# Altium schematic sheet SchematicV2.schdoc
size 881 x 502 mm
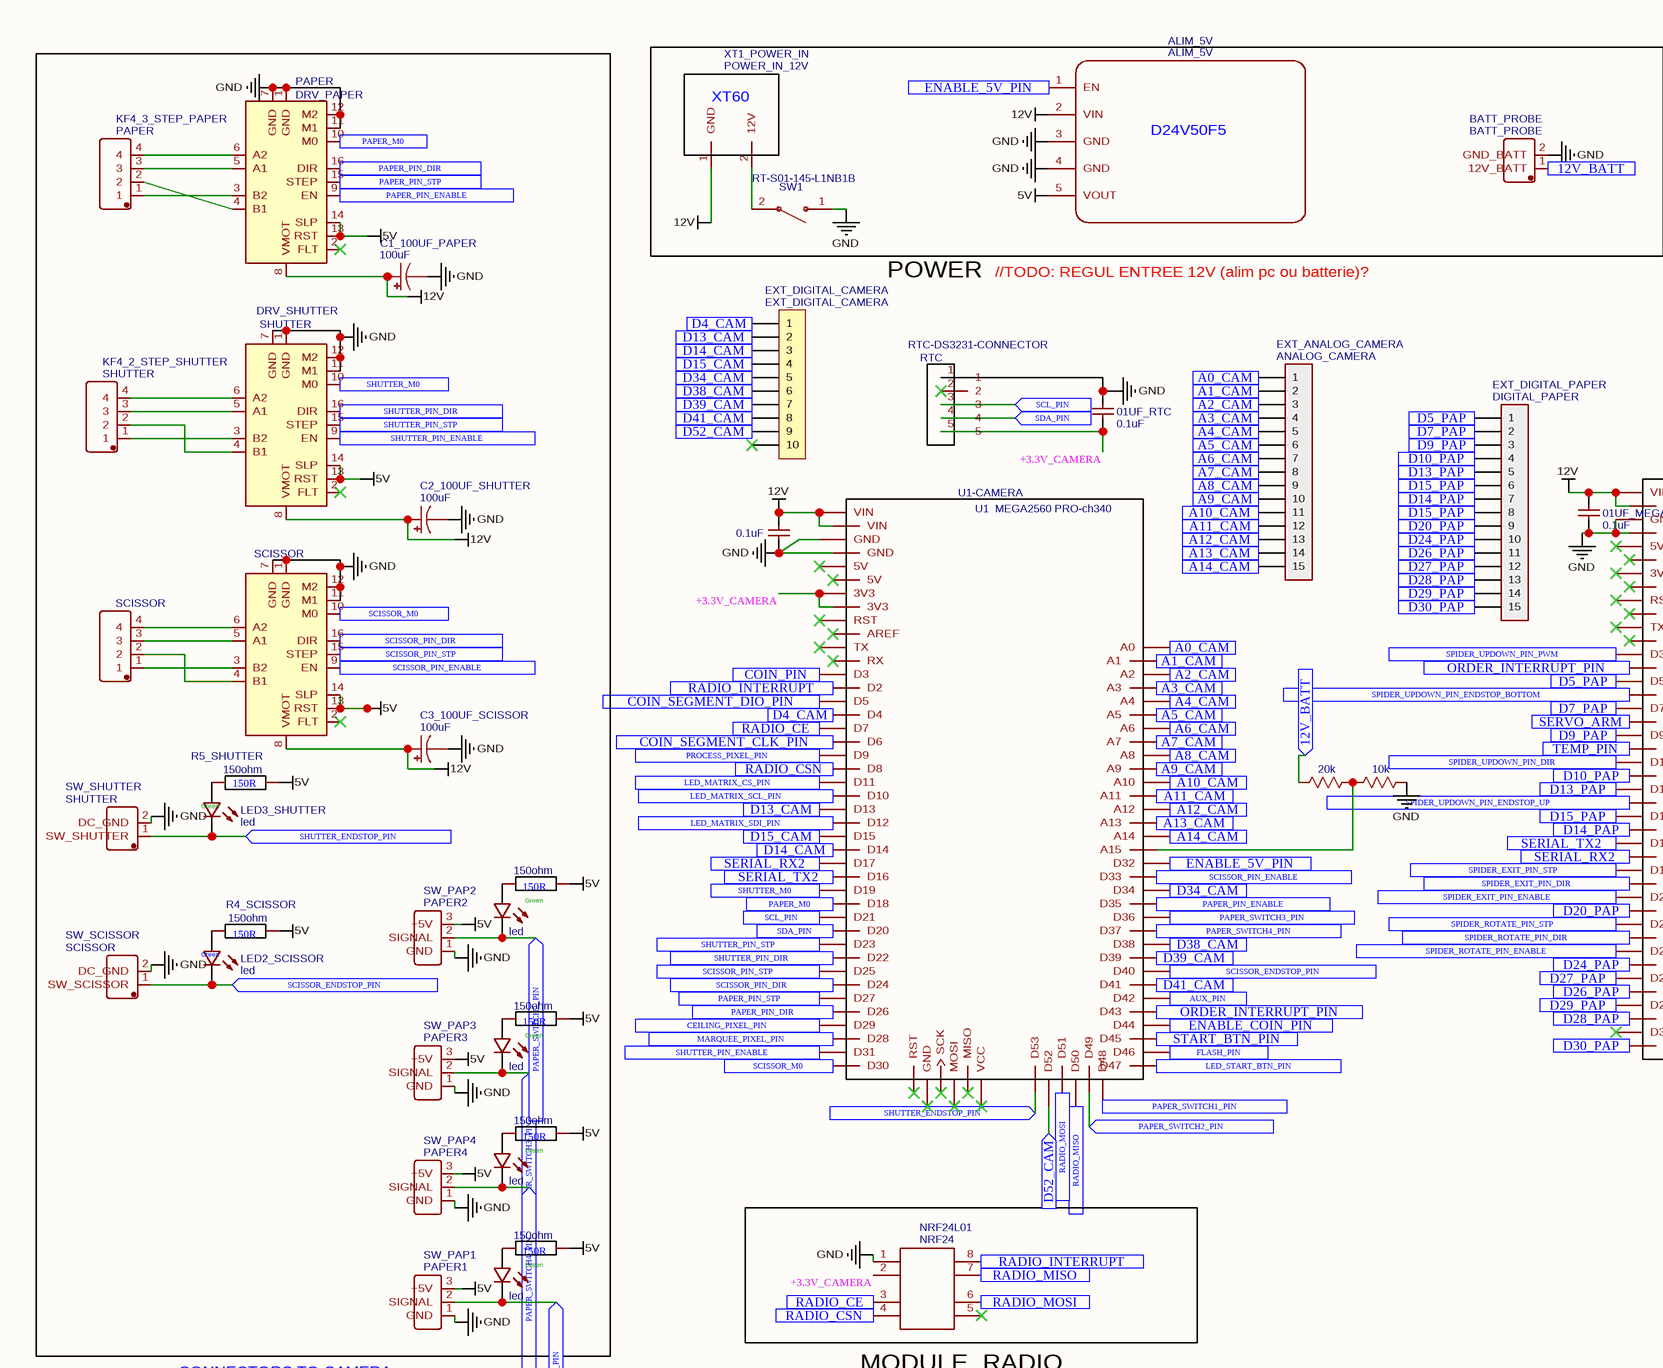
[diagram p0: SchematicV2.schdoc, top left]
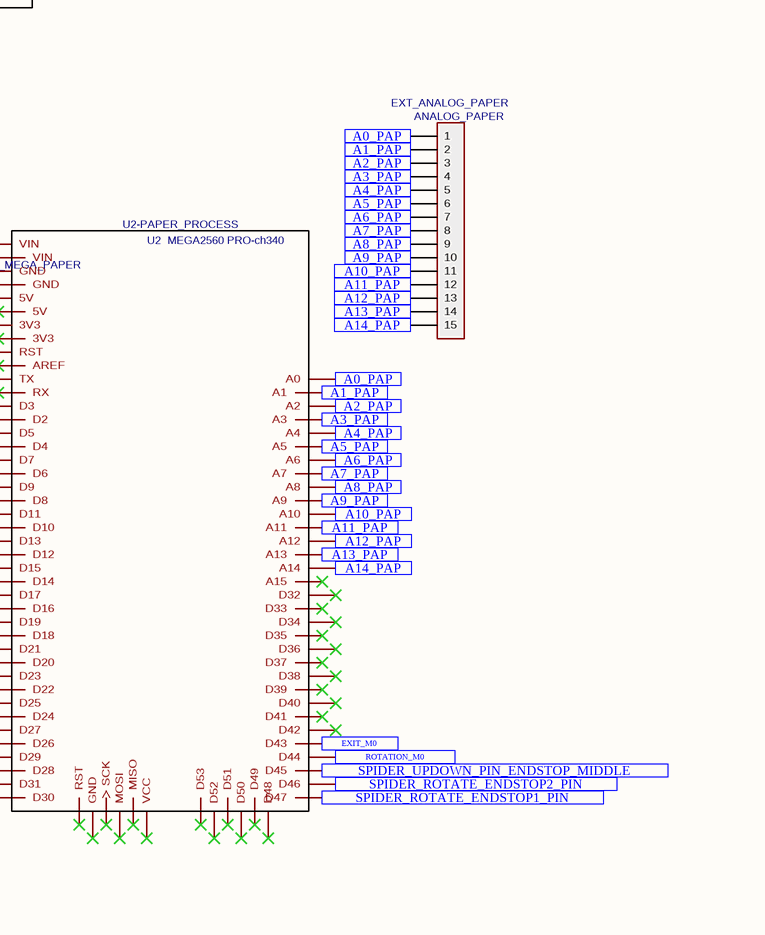
[diagram p1: SchematicV2.schdoc, top right]
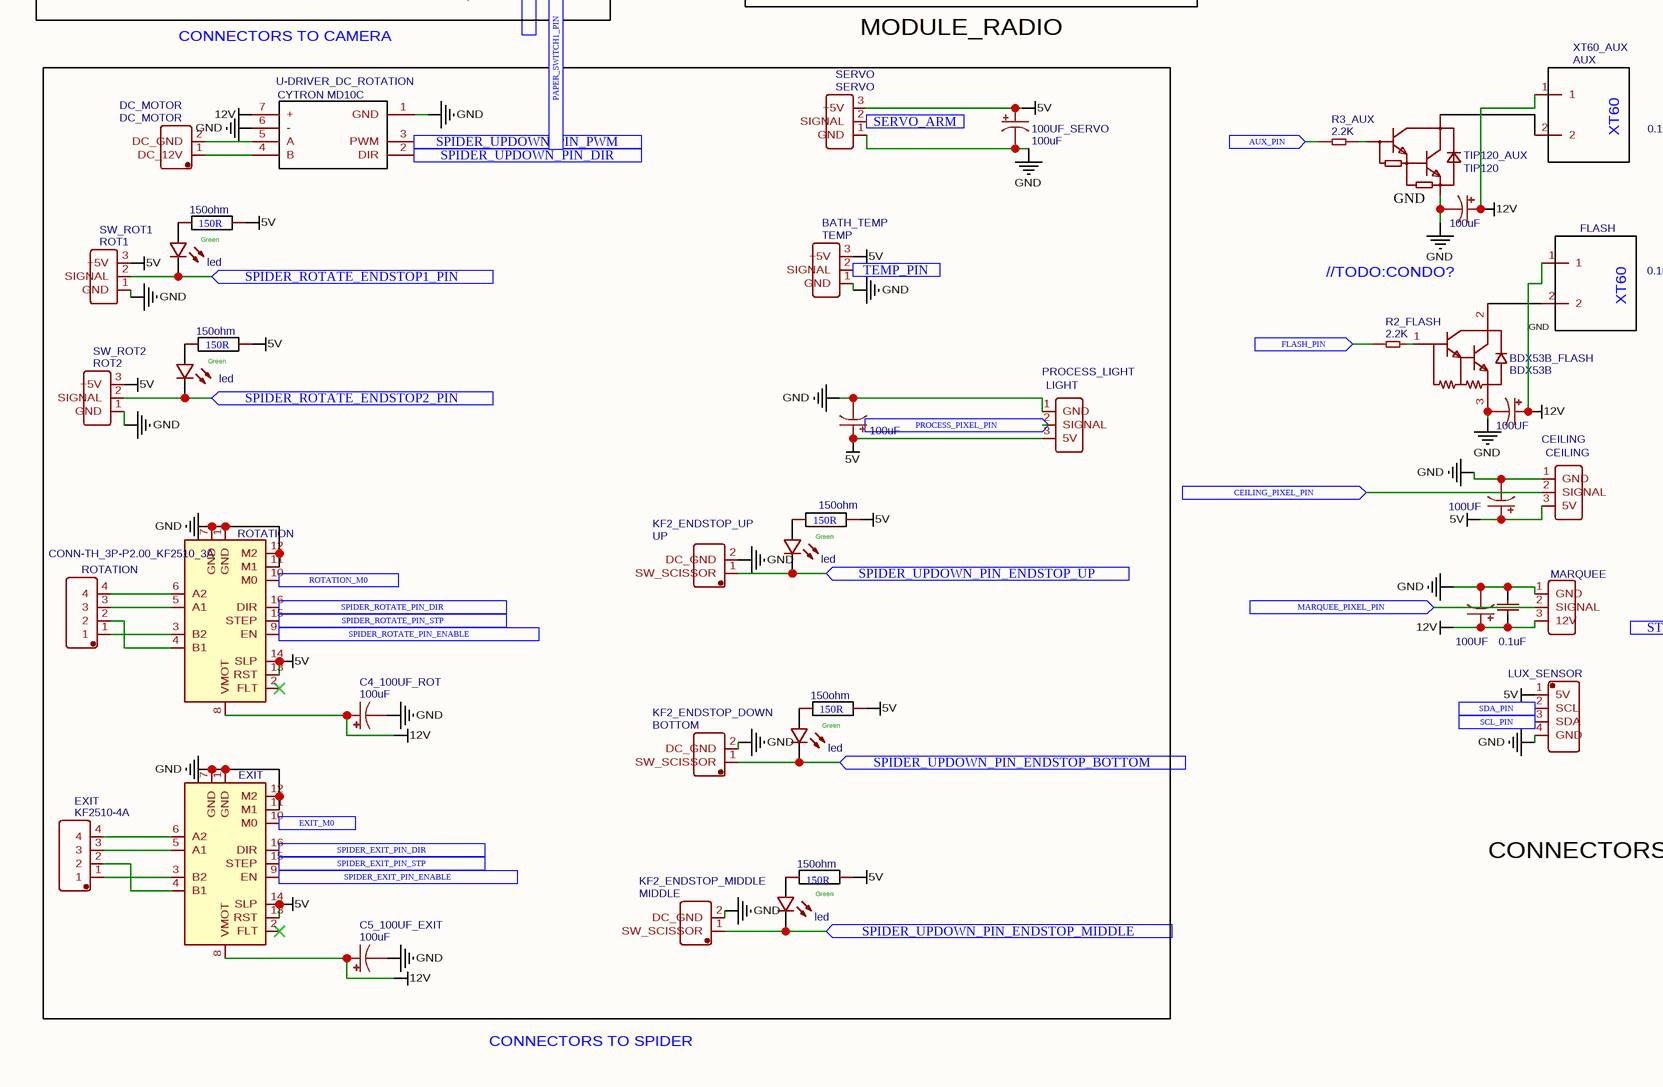
[diagram p2: SchematicV2.schdoc, bottom left]
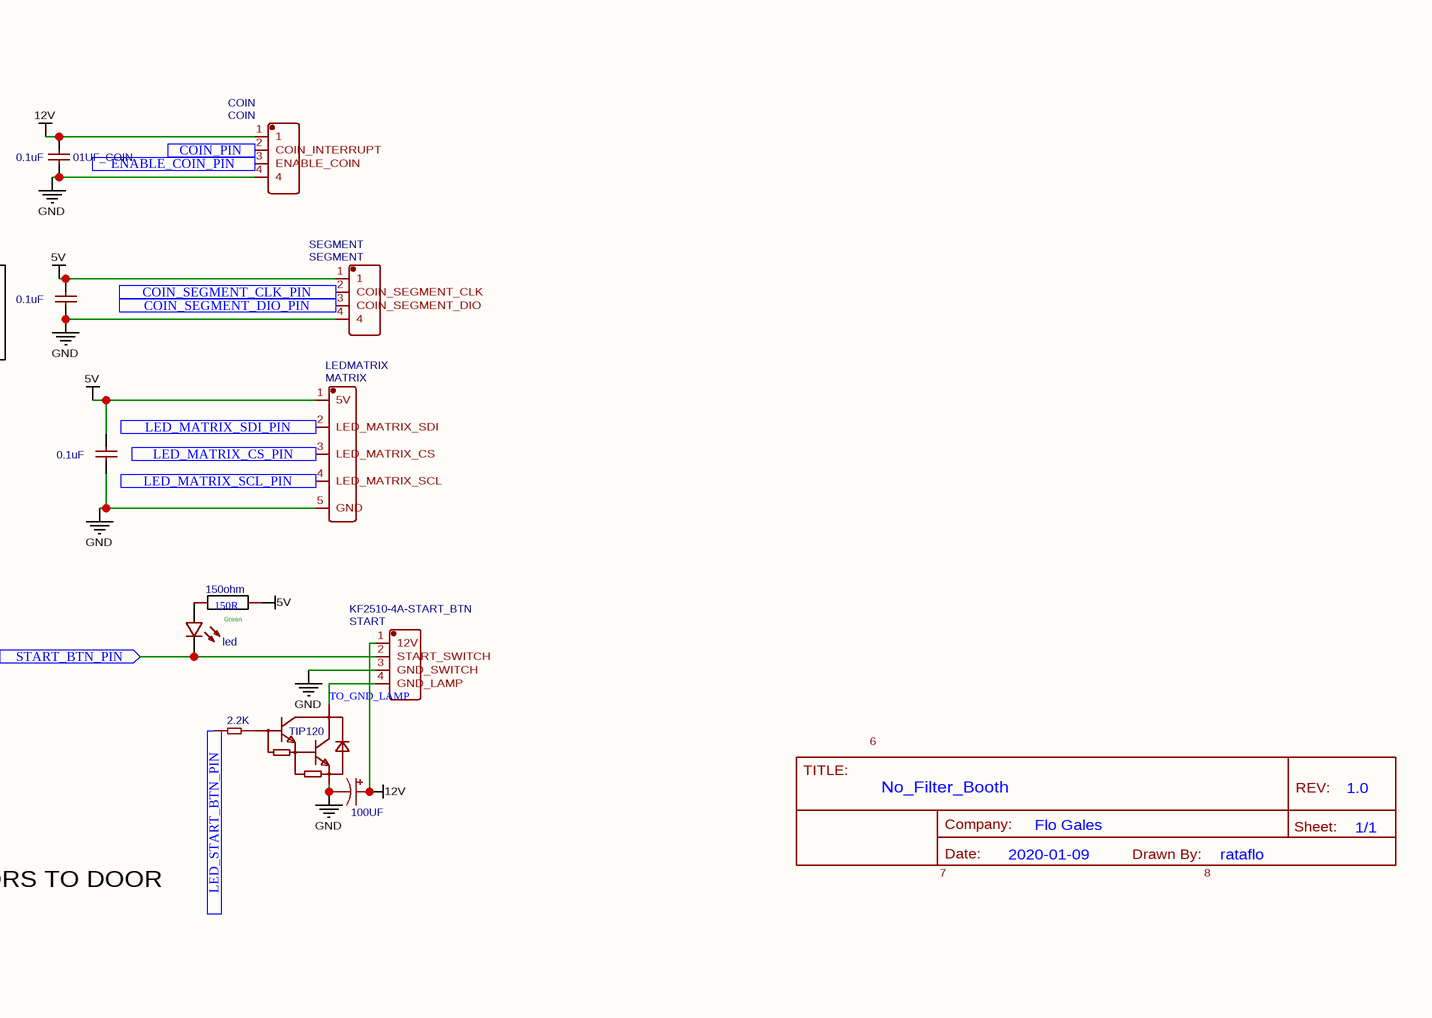
[diagram p3: SchematicV2.schdoc, bottom right]

## Parts
01UF_COIN  0.1uF  [100NF_CONDO]
01UF_MARQUEE  0.1uF  [100NF_CONDO]
01UF_MATRIX  0.1uF  [100NF_CONDO]
01UF_MEGA_PAPER  0.1uF  [100NF_CONDO]
01UF_RTC  0.1uF  [100NF_CONDO]
01UF_SEGMENT  0.1uF  [100NF_CONDO]
100UF_AUX  100uF  [CPOL-RADIAL-100UF-25V]
100UF_CEILING  100UF  [CPOL-RADIAL-100UF-25V]
100UF_FLASH  100UF  [CPOL-RADIAL-100UF-25V]
100UF_MARQUEE  100UF  [CPOL-RADIAL-100UF-25V]
100UF_MEGA_CAMERA  0.1uF  [100NF_CONDO]
100UF_PROCESS_LIGHT  100uF  [CPOL-RADIAL-100UF-25V]
100UF_SERVO  100uF  [CPOL-RADIAL-100UF-25V]
100UF_STARTBTN  100UF  [CPOL-RADIAL-100UF-25V]
ALIM_5V  ALIM_5V  [D24V50F5]
BATH_TEMP  TEMP  [CONN-TH_3P-P2.00_KF2510_3A]
BATT_PROBE  BATT_PROBE  [CONN-TH_KF2510-2A]
BDX53B_FLASH  BDX53B  [TO-220]
C1_100UF_PAPER  100uF  [CPOL-RADIAL-100UF-25V]
C2_100UF_SHUTTER  100uF  [CPOL-RADIAL-100UF-25V]
C3_100UF_SCISSOR  100uF  [CPOL-RADIAL-100UF-25V]
C4_100UF_ROT  100uF  [CPOL-RADIAL-100UF-25V]
C5_100UF_EXIT  100uF  [CPOL-RADIAL-100UF-25V]
CEILING  CEILING  [CONN-TH_3P-P2.00_KF2510_3A]
COIN  COIN  [CONN-TH_4P-P2.54_KF2510-4A]
DC_MOTOR  DC_MOTOR  [CONN-TH_KF2510-2A]
DRV_EXIT  EXIT  [POLOLU_BREAKOUT-16_15.2X20.3MM]
DRV_PAPER  PAPER  [POLOLU_BREAKOUT-16_15.2X20.3MM]
DRV_ROT  ROTATION  [POLOLU_BREAKOUT-16_15.2X20.3MM]
DRV_SCISSOR  SCISSOR  [POLOLU_BREAKOUT-16_15.2X20.3MM]
DRV_SHUTTER  SHUTTER  [POLOLU_BREAKOUT-16_15.2X20.3MM]
EXIT  KF2510-4A  [CONN-TH_4P-P2.54_KF2510-4A]
EXT_ANALOG_CAMERA  ANALOG_CAMERA  [DUPONT_MALE_16X1_ARNOZ]
EXT_ANALOG_PAPER  ANALOG_PAPER  [DUPONT_MALE_16X1_ARNOZ]
EXT_DIGITAL_CAMERA  EXT_DIGITAL_CAMERA  [1*10P_FEMALE]
EXT_DIGITAL_PAPER  DIGITAL_PAPER  [DUPONT_MALE_16X1_ARNOZ]
KF2_ENDSTOP_DOWN  BOTTOM  [CONN-TH_KF2510-2A]
KF2_ENDSTOP_MIDDLE  MIDDLE  [CONN-TH_KF2510-2A]
KF2_ENDSTOP_UP  UP  [CONN-TH_KF2510-2A]
KF4_2_STEP_SHUTTER  SHUTTER  [CONN-TH_4P-P2.54_KF2510-4A]
KF4_3_STEP_PAPER  PAPER  [CONN-TH_4P-P2.54_KF2510-4A]
KF2510-4A-START_BTN  START  [CONN-TH_4P-P2.54_KF2510-4A]
KF2510-4A_ROT  ROTATION  [CONN-TH_4P-P2.54_KF2510-4A]
LED  led  [5MM_LED_2.54]
LED2_SCISSOR  led  [5MM_LED_2.54]
LED3_SHUTTER  led  [5MM_LED_2.54]
LED__MIDDLE  led  [5MM_LED_2.54]
LED__START  led  [5MM_LED_2.54]
LED_BOTTOM  led  [5MM_LED_2.54]
LED_PAP1  led  [5MM_LED_2.54]
LED_PAP2  led  [5MM_LED_2.54]
LED_PAP3  led  [5MM_LED_2.54]
LED_PAP4  led  [5MM_LED_2.54]
LED_ROT2  led  [5MM_LED_2.54]
LED_UP  led  [5MM_LED_2.54]
LEDMATRIX  MATRIX  [KF2510-5A]
LUX_SENSOR  LUX_SENSOR  [CONN-TH_4P-P2.54_KF2510-4A]
MARQUEE  MARQUEE  [CONN-TH_3P-P2.00_KF2510_3A]
NRF24L01  NRF24  [HEADER 4X2]
PROCESS_LIGHT  LIGHT  [CONN-TH_3P-P2.00_KF2510_3A]
R1_20K_12VBATT  20k  [PKG-0.25W RESISTOR]
R1_START  150ohm  [ER_RESISTOR_150R/0.6_W]
R1_STARTBTN  2.2K  [RES-2.3]
R1_UP  150ohm  [ER_RESISTOR_150R/0.6_W]
R2_10K_12VBATT  10k  [PKG-0.25W RESISTOR]
R2_BOTTOM  150ohm  [ER_RESISTOR_150R/0.6_W]
R2_FLASH  2.2K  [RES-2.3]
R3_AUX  2.2K  [RES-2.3]
R3_MIDDLE  150ohm  [ER_RESISTOR_150R/0.6_W]
R4_SCISSOR  150ohm  [ER_RESISTOR_150R/0.6_W]
R5_SHUTTER  150ohm  [ER_RESISTOR_150R/0.6_W]
R_PAP1  150ohm  [ER_RESISTOR_150R/0.6_W]
R_PAP2  150ohm  [ER_RESISTOR_150R/0.6_W]
R_PAP3  150ohm  [ER_RESISTOR_150R/0.6_W]
R_PAP4  150ohm  [ER_RESISTOR_150R/0.6_W]
R_ROT1  150ohm  [ER_RESISTOR_150R/0.6_W]
R_ROT2  150ohm  [ER_RESISTOR_150R/0.6_W]
RTC-DS3231-CONNECTOR  RTC  [5PIN DUPONT]
SEGMENT  SEGMENT  [CONN-TH_4P-P2.54_KF2510-4A]
SERVO  SERVO  [CONN-TH_3P-P2.00_KF2510_3A]
STEP_SCISSOR  SCISSOR  [CONN-TH_4P-P2.54_KF2510-4A]
SW1  RT-S01-145-L1NB1B  [SW-TH_RT-S01-145-L1NB1B]
SW_PAP1  PAPER1  [CONN-TH_3P-P2.00_KF2510_3A]
SW_PAP2  PAPER2  [CONN-TH_3P-P2.00_KF2510_3A]
SW_PAP3  PAPER3  [CONN-TH_3P-P2.00_KF2510_3A]
SW_PAP4  PAPER4  [CONN-TH_3P-P2.00_KF2510_3A]
SW_ROT1  ROT1  [CONN-TH_3P-P2.00_KF2510_3A]
SW_ROT2  ROT2  [CONN-TH_3P-P2.00_KF2510_3A]
SW_SCISSOR  SCISSOR  [CONN-TH_KF2510-2A]
SW_SHUTTER  SHUTTER  [CONN-TH_KF2510-2A]
TEST  test2  (value not drawn)
TIP120_AUX  TIP120  [TO-220-3_L10.0-W4.5-P2.54-L]
TIP120_STARTBTN  TIP120  [TO-220-3_L10.0-W4.5-P2.54-L]
U1-CAMERA  CAMERA  [MEGA2560 PRO-CH340G]  (value not drawn)
U2-PAPER_PROCESS  PAPER_PROCESS  [MEGA2560 PRO-CH340G]  (value not drawn)
U-DRIVER_DC_ROTATION  CYTRON MD10C  [MD10C]
XT1_POWER_IN  POWER_IN_12V  [XT60]
XT60-FLASH  FLASH  [XT60]
XT60_AUX  AUX  [XT60]

## Ports
12V_BATT (in), A0_CAM (in), A0_PAP (in), A1_CAM (in), A1_PAP (in), A2_CAM (in), A2_PAP (in), A3_CAM (in), A3_PAP (in), A4_CAM (in), A4_PAP (in), A5_CAM (in), A5_PAP (in), A6_CAM (in), A6_PAP (in), A7_CAM (in), A7_PAP (in), A8_CAM (in), A8_PAP (in), A9_CAM (in), A9_PAP (in), A10_CAM (in), A10_PAP (in), A11_CAM (in), A11_PAP (in), A12_CAM (in), A12_PAP (in), A13_CAM (in), A13_PAP (in), A14_CAM (in), A14_PAP (in), AUX_PIN (in), CEILING_PIXEL_PIN (in), COIN_PIN (in), COIN_SEGMENT_CLK_PIN (in), COIN_SEGMENT_DIO_PIN (in), D4_CAM (in), D5_PAP (in), D7_PAP (in), D9_PAP (in), D10_PAP (in), D13_CAM (in), D13_PAP (in), D14_CAM (in), D14_PAP (in), D15_CAM (in), D15_PAP (in), D20_PAP (in), D24_PAP (in), D26_PAP (in), D27_PAP (in), D28_PAP (in), D29_PAP (in), D30_PAP (in), D34_CAM (in), D38_CAM (in), D39_CAM (in), D41_CAM (in), D52_CAM (in), ENABLE_5V_PIN (in), ENABLE_COIN_PIN (in), EXIT_M0 (in), FLASH_PIN (in), LED_MATRIX_CS_PIN (in), LED_MATRIX_SCL_PIN (in), LED_MATRIX_SDI_PIN (in), LED_START_BTN_PIN (in), MARQUEE_PIXEL_PIN (in), ORDER_INTERRUPT_PIN (in), PAPER_M0 (in), PAPER_PIN_DIR (in), PAPER_PIN_ENABLE (in), PAPER_PIN_STP (in), PAPER_SWITCH1_PIN (in), PAPER_SWITCH2_PIN (in), PAPER_SWITCH3_PIN (in), PAPER_SWITCH4_PIN (in), PROCESS_PIXEL_PIN (in), RADIO_CE (in), RADIO_CSN (in), RADIO_INTERRUPT (in), RADIO_MISO (in), RADIO_MOSI (in), ROTATION_M0 (in), SCISSOR_ENDSTOP_PIN (in), SCISSOR_M0 (in), SCISSOR_PIN_DIR (in), SCISSOR_PIN_ENABLE (in), SCISSOR_PIN_STP (in), SCL_PIN (in), SDA_PIN (in), SERIAL_RX2 (in), SERIAL_TX2 (in), SERVO_ARM (in), SHUTTER_ENDSTOP_PIN (in), SHUTTER_M0 (in), SHUTTER_PIN_DIR (in), SHUTTER_PIN_ENABLE (in), SHUTTER_PIN_STP (in), SPIDER_EXIT_PIN_DIR (in), SPIDER_EXIT_PIN_ENABLE (in), SPIDER_EXIT_PIN_STP (in), SPIDER_ROTATE_ENDSTOP1_PIN (in), SPIDER_ROTATE_ENDSTOP2_PIN (in), SPIDER_ROTATE_PIN_DIR (in), SPIDER_ROTATE_PIN_ENABLE (in), SPIDER_ROTATE_PIN_STP (in), SPIDER_UPDOWN_PIN_DIR (in), SPIDER_UPDOWN_PIN_ENDSTOP_BOTTOM (in), SPIDER_UPDOWN_PIN_ENDSTOP_MIDDLE (in), SPIDER_UPDOWN_PIN_ENDSTOP_UP (in), SPIDER_UPDOWN_PIN_PWM (in), START_BTN_PIN (in), TEMP_PIN (in)

## Nets
5V: 01UF_MATRIX.2 01UF_SEGMENT.2 100UF_CEILING.1(+) 100UF_PROCESS_LIGHT.1(+) 100UF_SERVO.1(+) ALIM_5V.5(VOUT) BATH_TEMP.3(+5V) CEILING.3(5V) DRV_EXIT.13(RST) DRV_EXIT.14(SLP) DRV_PAPER.13(RST) DRV_PAPER.14(SLP) DRV_ROT.13(RST) DRV_ROT.14(SLP) DRV_SCISSOR.13(RST) DRV_SCISSOR.14(SLP) DRV_SHUTTER.13(RST) DRV_SHUTTER.14(SLP) LEDMATRIX.1(5V) LUX_SENSOR.1(5V) PROCESS_LIGHT.3(5V) R1_START.1 R1_UP.1 R2_BOTTOM.1 R3_MIDDLE.1 R4_SCISSOR.1 R5_SHUTTER.1 R_PAP1.1 R_PAP2.1 R_PAP3.1 R_PAP4.1 R_ROT1.1 R_ROT2.1 SEGMENT.1 SERVO.3(+5V) SW_PAP1.3(+5V) SW_PAP2.3(+5V) SW_PAP3.3(+5V) SW_PAP4.3(+5V) SW_ROT1.3(+5V) SW_ROT2.3(+5V)
12V: 01UF_COIN.2 01UF_MARQUEE.1 01UF_MEGA_PAPER.2 100UF_AUX.1(+) 100UF_FLASH.1(+) 100UF_MARQUEE.1(+) 100UF_MEGA_CAMERA.2 100UF_STARTBTN.1(+) ALIM_5V.2(VIN) C1_100UF_PAPER.1(+) C2_100UF_SHUTTER.1(+) C3_100UF_SCISSOR.1(+) C4_100UF_ROT.1(+) C5_100UF_EXIT.1(+) COIN.1 DRV_EXIT.8(VMOT) DRV_PAPER.8(VMOT) DRV_ROT.8(VMOT) DRV_SCISSOR.8(VMOT) DRV_SHUTTER.8(VMOT) KF2510-4A-START_BTN.1(12V) MARQUEE.3(12V) U1-CAMERA.85(VIN) U1-CAMERA.86(VIN) U2-PAPER_PROCESS.85(VIN) U2-PAPER_PROCESS.86(VIN) U-DRIVER_DC_ROTATION.7(+) XT1_POWER_IN.1(GND) XT60-FLASH.1 XT60_AUX.1
GND: 01UF_COIN.1 01UF_MARQUEE.2 01UF_MATRIX.1 01UF_MEGA_PAPER.1 01UF_RTC.2 01UF_SEGMENT.1 100UF_AUX.2(-) 100UF_CEILING.2(-) 100UF_FLASH.2(-) 100UF_MARQUEE.2(-) 100UF_MEGA_CAMERA.1 100UF_PROCESS_LIGHT.2(-) 100UF_SERVO.2(-) 100UF_STARTBTN.2(-) ALIM_5V.3(GND) ALIM_5V.4(GND) BATH_TEMP.1(GND) BATT_PROBE.2(GND_BATT) BDX53B_FLASH.3(E) C1_100UF_PAPER.2(-) C2_100UF_SHUTTER.2(-) C3_100UF_SCISSOR.2(-) C4_100UF_ROT.2(-) C5_100UF_EXIT.2(-) CEILING.1(GND) COIN.4 DRV_EXIT.1(GND) DRV_EXIT.7(GND) DRV_EXIT.11(M1) DRV_EXIT.12(M2) DRV_PAPER.1(GND) DRV_PAPER.7(GND) DRV_PAPER.11(M1) DRV_PAPER.12(M2) DRV_ROT.1(GND) DRV_ROT.7(GND) DRV_ROT.11(M1) DRV_ROT.12(M2) DRV_SCISSOR.1(GND) DRV_SCISSOR.7(GND) DRV_SCISSOR.11(M1) DRV_SCISSOR.12(M2) DRV_SHUTTER.1(GND) DRV_SHUTTER.7(GND) DRV_SHUTTER.11(M1) DRV_SHUTTER.12(M2) KF2_ENDSTOP_DOWN.2(DC_GND) KF2_ENDSTOP_MIDDLE.2(DC_GND) KF2_ENDSTOP_UP.2(DC_GND) KF2510-4A-START_BTN.3(GND_SWITCH) LEDMATRIX.5(GND) LUX_SENSOR.4(GND) MARQUEE.1(GND) NRF24L01.1 PROCESS_LIGHT.1(GND) R2_10K_12VBATT.1 RTC-DS3231-CONNECTOR.1 SEGMENT.4 SERVO.1(GND) SW1.1 SW_PAP1.1(GND) SW_PAP2.1(GND) SW_PAP3.1(GND) SW_PAP4.1(GND) SW_ROT1.1(GND) SW_ROT2.1(GND) SW_SCISSOR.2(DC_GND) SW_SHUTTER.2(DC_GND) TIP120_AUX.3(E) TIP120_STARTBTN.3(E) U1-CAMERA.83(GND) U1-CAMERA.84(GND) U2-PAPER_PROCESS.83(GND) U2-PAPER_PROCESS.84(GND) U-DRIVER_DC_ROTATION.1(GND) U-DRIVER_DC_ROTATION.6(-)
12V_BATT: BATT_PROBE.1(12V_BATT) R1_20K_12VBATT.2 ; port 12V_BATT
+3.3V_CAMERA: 01UF_RTC.1 NRF24L01.2 RTC-DS3231-CONNECTOR.5 U1-CAMERA.79(3V3) U1-CAMERA.80(3V3)
A0_CAM: EXT_ANALOG_CAMERA.1 U1-CAMERA.1(A0) ; port A0_CAM
A0_PAP: EXT_ANALOG_PAPER.1 U2-PAPER_PROCESS.1(A0) ; port A0_PAP
A1_CAM: EXT_ANALOG_CAMERA.2 U1-CAMERA.2(A1) ; port A1_CAM
A1_PAP: EXT_ANALOG_PAPER.2 U2-PAPER_PROCESS.2(A1) ; port A1_PAP
A2_CAM: EXT_ANALOG_CAMERA.3 U1-CAMERA.3(A2) ; port A2_CAM
A2_PAP: EXT_ANALOG_PAPER.3 U2-PAPER_PROCESS.3(A2) ; port A2_PAP
A3_CAM: EXT_ANALOG_CAMERA.4 U1-CAMERA.4(A3) ; port A3_CAM
A3_PAP: EXT_ANALOG_PAPER.4 U2-PAPER_PROCESS.4(A3) ; port A3_PAP
A4_CAM: EXT_ANALOG_CAMERA.5 U1-CAMERA.5(A4) ; port A4_CAM
A4_PAP: EXT_ANALOG_PAPER.5 U2-PAPER_PROCESS.5(A4) ; port A4_PAP
A5_CAM: EXT_ANALOG_CAMERA.6 U1-CAMERA.6(A5) ; port A5_CAM
A5_PAP: EXT_ANALOG_PAPER.6 U2-PAPER_PROCESS.6(A5) ; port A5_PAP
A6_CAM: EXT_ANALOG_CAMERA.7 U1-CAMERA.7(A6) ; port A6_CAM
A6_PAP: EXT_ANALOG_PAPER.7 U2-PAPER_PROCESS.7(A6) ; port A6_PAP
A7_CAM: EXT_ANALOG_CAMERA.8 U1-CAMERA.8(A7) ; port A7_CAM
A7_PAP: EXT_ANALOG_PAPER.8 U2-PAPER_PROCESS.8(A7) ; port A7_PAP
A8_CAM: EXT_ANALOG_CAMERA.9 U1-CAMERA.9(A8) ; port A8_CAM
A8_PAP: EXT_ANALOG_PAPER.9 U2-PAPER_PROCESS.9(A8) ; port A8_PAP
A9_CAM: EXT_ANALOG_CAMERA.10 U1-CAMERA.10(A9) ; port A9_CAM
A9_PAP: EXT_ANALOG_PAPER.10 U2-PAPER_PROCESS.10(A9) ; port A9_PAP
A10_CAM: EXT_ANALOG_CAMERA.11 U1-CAMERA.11(A10) ; port A10_CAM
A10_PAP: EXT_ANALOG_PAPER.11 U2-PAPER_PROCESS.11(A10) ; port A10_PAP
A11_CAM: EXT_ANALOG_CAMERA.12 U1-CAMERA.12(A11) ; port A11_CAM
A11_PAP: EXT_ANALOG_PAPER.12 U2-PAPER_PROCESS.12(A11) ; port A11_PAP
A12_CAM: EXT_ANALOG_CAMERA.13 U1-CAMERA.13(A12) ; port A12_CAM
A12_PAP: EXT_ANALOG_PAPER.13 U2-PAPER_PROCESS.13(A12) ; port A12_PAP
A13_CAM: EXT_ANALOG_CAMERA.14 U1-CAMERA.14(A13) ; port A13_CAM
A13_PAP: EXT_ANALOG_PAPER.14 U2-PAPER_PROCESS.14(A13) ; port A13_PAP
A14_CAM: EXT_ANALOG_CAMERA.15 U1-CAMERA.15(A14) ; port A14_CAM
A14_PAP: EXT_ANALOG_PAPER.15 U2-PAPER_PROCESS.15(A14) ; port A14_PAP
AUX_PIN: R3_AUX.1 U1-CAMERA.27(D42) ; port AUX_PIN
CEILING_PIXEL_PIN: CEILING.2(SIGNAL) U1-CAMERA.48(D29) ; port CEILING_PIXEL_PIN
COIN_PIN: COIN.2(COIN_INTERRUPT) U1-CAMERA.74(D3) ; port COIN_PIN
COIN_SEGMENT_CLK_PIN: SEGMENT.2(COIN_SEGMENT_CLK) U1-CAMERA.69(D6) ; port COIN_SEGMENT_CLK_PIN
COIN_SEGMENT_DIO_PIN: SEGMENT.3(COIN_SEGMENT_DIO) U1-CAMERA.72(D5) ; port COIN_SEGMENT_DIO_PIN
D4_CAM: EXT_DIGITAL_CAMERA.1 U1-CAMERA.71(D4) ; port D4_CAM
D5_PAP: EXT_DIGITAL_PAPER.1 U2-PAPER_PROCESS.72(D5) ; port D5_PAP
D7_PAP: EXT_DIGITAL_PAPER.2 U2-PAPER_PROCESS.70(D7) ; port D7_PAP
D9_PAP: EXT_DIGITAL_PAPER.3 U2-PAPER_PROCESS.68(D9) ; port D9_PAP
D10_PAP: EXT_DIGITAL_PAPER.4 U2-PAPER_PROCESS.65(D10) ; port D10_PAP
D13_CAM: EXT_DIGITAL_CAMERA.2 U1-CAMERA.64(D13) ; port D13_CAM
D13_PAP: EXT_DIGITAL_PAPER.5 U2-PAPER_PROCESS.64(D13) ; port D13_PAP
D14_CAM: EXT_DIGITAL_CAMERA.3 U1-CAMERA.61(D14) ; port D14_CAM
D14_PAP: EXT_DIGITAL_PAPER.7 U2-PAPER_PROCESS.61(D14) ; port D14_PAP
D15_CAM: EXT_DIGITAL_CAMERA.4 U1-CAMERA.62(D15) ; port D15_CAM
D15_PAP: EXT_DIGITAL_PAPER.6 EXT_DIGITAL_PAPER.8 U2-PAPER_PROCESS.62(D15) ; port D15_PAP
D20_PAP: EXT_DIGITAL_PAPER.9 U2-PAPER_PROCESS.55(D20) ; port D20_PAP
D24_PAP: EXT_DIGITAL_PAPER.10 U2-PAPER_PROCESS.51(D24) ; port D24_PAP
D26_PAP: EXT_DIGITAL_PAPER.11 U2-PAPER_PROCESS.49(D26) ; port D26_PAP
D27_PAP: EXT_DIGITAL_PAPER.12 U2-PAPER_PROCESS.50(D27) ; port D27_PAP
D28_PAP: EXT_DIGITAL_PAPER.13 U2-PAPER_PROCESS.47(D28) ; port D28_PAP
D29_PAP: EXT_DIGITAL_PAPER.14 U2-PAPER_PROCESS.48(D29) ; port D29_PAP
D30_PAP: EXT_DIGITAL_PAPER.15 U2-PAPER_PROCESS.45(D30) ; port D30_PAP
D34_CAM: EXT_DIGITAL_CAMERA.5 U1-CAMERA.19(D34) ; port D34_CAM
D38_CAM: EXT_DIGITAL_CAMERA.6 U1-CAMERA.23(D38) ; port D38_CAM
D39_CAM: EXT_DIGITAL_CAMERA.7 U1-CAMERA.24(D39) ; port D39_CAM
D41_CAM: EXT_DIGITAL_CAMERA.8 U1-CAMERA.26(D41) ; port D41_CAM
D52_CAM: EXT_DIGITAL_CAMERA.9 U1-CAMERA.37(D52) ; port D52_CAM
ENABLE_5V_PIN: ALIM_5V.1(EN) U1-CAMERA.17(D32) ; port ENABLE_5V_PIN
ENABLE_COIN_PIN: COIN.3(ENABLE_COIN) U1-CAMERA.29(D44) ; port ENABLE_COIN_PIN
EXIT_M0: DRV_EXIT.10(M0) U2-PAPER_PROCESS.28(D43) ; port EXIT_M0
FLASH_PIN: R2_FLASH.1 U1-CAMERA.31(D46) ; port FLASH_PIN
LED_MATRIX_CS_PIN: LEDMATRIX.3(LED_MATRIX_CS) U1-CAMERA.66(D11) ; port LED_MATRIX_CS_PIN
LED_MATRIX_SCL_PIN: LEDMATRIX.4(LED_MATRIX_SCL) U1-CAMERA.65(D10) ; port LED_MATRIX_SCL_PIN
LED_MATRIX_SDI_PIN: LEDMATRIX.2(LED_MATRIX_SDI) U1-CAMERA.63(D12) ; port LED_MATRIX_SDI_PIN
LED_START_BTN_PIN: R1_STARTBTN.1 U1-CAMERA.32(D47) ; port LED_START_BTN_PIN
MARQUEE_PIXEL_PIN: MARQUEE.2(SIGNAL) U1-CAMERA.47(D28) ; port MARQUEE_PIXEL_PIN
ORDER_INTERRUPT_PIN: U1-CAMERA.28(D43) U2-PAPER_PROCESS.73(D2) ; port ORDER_INTERRUPT_PIN
PAPER_M0: DRV_PAPER.10(M0) U1-CAMERA.57(D18) ; port PAPER_M0
PAPER_PIN_DIR: DRV_PAPER.16(DIR) U1-CAMERA.49(D26) ; port PAPER_PIN_DIR
PAPER_PIN_ENABLE: DRV_PAPER.9(EN) U1-CAMERA.20(D35) ; port PAPER_PIN_ENABLE
PAPER_PIN_STP: DRV_PAPER.15(STEP) U1-CAMERA.50(D27) ; port PAPER_PIN_STP
PAPER_SWITCH1_PIN: LED_PAP1.2(C) SW_PAP1.2(SIGNAL) U1-CAMERA.33(D48) ; port PAPER_SWITCH1_PIN
PAPER_SWITCH2_PIN: LED_PAP2.2(C) SW_PAP2.2(SIGNAL) U1-CAMERA.34(D49) ; port PAPER_SWITCH2_PIN
PAPER_SWITCH3_PIN: LED_PAP3.2(C) SW_PAP3.2(SIGNAL) U1-CAMERA.21(D36) ; port PAPER_SWITCH3_PIN
PAPER_SWITCH4_PIN: LED_PAP4.2(C) SW_PAP4.2(SIGNAL) U1-CAMERA.22(D37) ; port PAPER_SWITCH4_PIN
PROCESS_PIXEL_PIN: PROCESS_LIGHT.2(SIGNAL) U1-CAMERA.68(D9) ; port PROCESS_PIXEL_PIN
RADIO_CE: NRF24L01.3 U1-CAMERA.70(D7) ; port RADIO_CE
RADIO_CSN: NRF24L01.4 U1-CAMERA.67(D8) ; port RADIO_CSN
RADIO_INTERRUPT: NRF24L01.8 U1-CAMERA.73(D2) ; port RADIO_INTERRUPT
RADIO_MISO: NRF24L01.7 U1-CAMERA.35(D50) ; port RADIO_MISO
RADIO_MOSI: NRF24L01.6 U1-CAMERA.36(D51) ; port RADIO_MOSI
ROTATION_M0: DRV_ROT.10(M0) U2-PAPER_PROCESS.29(D44) ; port ROTATION_M0
SCISSOR_ENDSTOP_PIN: LED2_SCISSOR.2(C) SW_SCISSOR.1(SW_SCISSOR) U1-CAMERA.25(D40) ; port SCISSOR_ENDSTOP_PIN
SCISSOR_M0: DRV_SCISSOR.10(M0) U1-CAMERA.45(D30) ; port SCISSOR_M0
SCISSOR_PIN_DIR: DRV_SCISSOR.16(DIR) U1-CAMERA.51(D24) ; port SCISSOR_PIN_DIR
SCISSOR_PIN_ENABLE: DRV_SCISSOR.9(EN) U1-CAMERA.18(D33) ; port SCISSOR_PIN_ENABLE
SCISSOR_PIN_STP: DRV_SCISSOR.15(STEP) U1-CAMERA.52(D25) ; port SCISSOR_PIN_STP
SCL_PIN: LUX_SENSOR.3(SDA) RTC-DS3231-CONNECTOR.3 U1-CAMERA.56(D21) ; port SCL_PIN
SDA_PIN: LUX_SENSOR.2(SCL) RTC-DS3231-CONNECTOR.4 U1-CAMERA.55(D20) ; port SDA_PIN
SERIAL_RX2: U1-CAMERA.60(D17) U2-PAPER_PROCESS.59(D16) ; port SERIAL_RX2
SERIAL_TX2: U1-CAMERA.59(D16) U2-PAPER_PROCESS.60(D17) ; port SERIAL_TX2
SERVO_ARM: SERVO.2(SIGNAL) U2-PAPER_PROCESS.69(D6) ; port SERVO_ARM
SHUTTER_ENDSTOP_PIN: LED3_SHUTTER.2(C) SW_SHUTTER.1(SW_SHUTTER) U1-CAMERA.38(D53) ; port SHUTTER_ENDSTOP_PIN
SHUTTER_M0: DRV_SHUTTER.10(M0) U1-CAMERA.58(D19) ; port SHUTTER_M0
SHUTTER_PIN_DIR: DRV_SHUTTER.16(DIR) U1-CAMERA.53(D22) ; port SHUTTER_PIN_DIR
SHUTTER_PIN_ENABLE: DRV_SHUTTER.9(EN) U1-CAMERA.46(D31) ; port SHUTTER_PIN_ENABLE
SHUTTER_PIN_STP: DRV_SHUTTER.15(STEP) U1-CAMERA.54(D23) ; port SHUTTER_PIN_STP
SPIDER_EXIT_PIN_DIR: DRV_EXIT.16(DIR) U2-PAPER_PROCESS.57(D18) ; port SPIDER_EXIT_PIN_DIR
SPIDER_EXIT_PIN_ENABLE: DRV_EXIT.9(EN) U2-PAPER_PROCESS.56(D21) ; port SPIDER_EXIT_PIN_ENABLE
SPIDER_EXIT_PIN_STP: DRV_EXIT.15(STEP) U2-PAPER_PROCESS.58(D19) ; port SPIDER_EXIT_PIN_STP
SPIDER_ROTATE_ENDSTOP1_PIN: LED.2(C) SW_ROT1.2(SIGNAL) U2-PAPER_PROCESS.32(D47) ; port SPIDER_ROTATE_ENDSTOP1_PIN
SPIDER_ROTATE_ENDSTOP2_PIN: LED_ROT2.2(C) SW_ROT2.2(SIGNAL) U2-PAPER_PROCESS.31(D46) ; port SPIDER_ROTATE_ENDSTOP2_PIN
SPIDER_ROTATE_PIN_DIR: DRV_ROT.16(DIR) U2-PAPER_PROCESS.53(D22) ; port SPIDER_ROTATE_PIN_DIR
SPIDER_ROTATE_PIN_ENABLE: DRV_ROT.9(EN) U2-PAPER_PROCESS.52(D25) ; port SPIDER_ROTATE_PIN_ENABLE
SPIDER_ROTATE_PIN_STP: DRV_ROT.15(STEP) U2-PAPER_PROCESS.54(D23) ; port SPIDER_ROTATE_PIN_STP
SPIDER_UPDOWN_PIN_DIR: U2-PAPER_PROCESS.66(D11) U-DRIVER_DC_ROTATION.2(DIR) ; port SPIDER_UPDOWN_PIN_DIR
SPIDER_UPDOWN_PIN_ENDSTOP_BOTTOM: KF2_ENDSTOP_DOWN.1(SW_SCISSOR) LED_BOTTOM.2(C) U2-PAPER_PROCESS.71(D4) ; port SPIDER_UPDOWN_PIN_ENDSTOP_BOTTOM
SPIDER_UPDOWN_PIN_ENDSTOP_MIDDLE: KF2_ENDSTOP_MIDDLE.1(SW_SCISSOR) LED__MIDDLE.2(C) U2-PAPER_PROCESS.30(D45) ; port SPIDER_UPDOWN_PIN_ENDSTOP_MIDDLE
SPIDER_UPDOWN_PIN_ENDSTOP_UP: KF2_ENDSTOP_UP.1(SW_SCISSOR) LED_UP.2(C) U2-PAPER_PROCESS.63(D12) ; port SPIDER_UPDOWN_PIN_ENDSTOP_UP
SPIDER_UPDOWN_PIN_PWM: U2-PAPER_PROCESS.74(D3) U-DRIVER_DC_ROTATION.3(PWM) ; port SPIDER_UPDOWN_PIN_PWM
START_BTN_PIN: KF2510-4A-START_BTN.2(START_SWITCH) LED__START.2(C) U1-CAMERA.30(D45) ; port START_BTN_PIN
TEMP_PIN: BATH_TEMP.2(SIGNAL) U2-PAPER_PROCESS.67(D8) ; port TEMP_PIN
TO_GND_LAMP: KF2510-4A-START_BTN.4(GND_LAMP) TIP120_STARTBTN.2(C)
NetBDX53B_FLASH_1: BDX53B_FLASH.1(B) R2_FLASH.2
NetBDX53B_FLASH_2: BDX53B_FLASH.2(C) XT60-FLASH.2
NetDC_MOTOR_1: DC_MOTOR.1(DC_12V) U-DRIVER_DC_ROTATION.4(B)
NetDC_MOTOR_2: DC_MOTOR.2(DC_GND) U-DRIVER_DC_ROTATION.5(A)
NetDRV_EXIT_3: DRV_EXIT.3(B2) EXIT.1
NetDRV_EXIT_4: DRV_EXIT.4(B1) EXIT.2
NetDRV_EXIT_5: DRV_EXIT.5(A1) EXIT.3
NetDRV_EXIT_6: DRV_EXIT.6(A2) EXIT.4
NetDRV_PAPER_3: DRV_PAPER.3(B2) KF4_3_STEP_PAPER.1
NetDRV_PAPER_4: DRV_PAPER.4(B1) KF4_3_STEP_PAPER.2
NetDRV_PAPER_5: DRV_PAPER.5(A1) KF4_3_STEP_PAPER.3
NetDRV_PAPER_6: DRV_PAPER.6(A2) KF4_3_STEP_PAPER.4
NetDRV_ROT_3: DRV_ROT.3(B2) KF2510-4A_ROT.1
NetDRV_ROT_4: DRV_ROT.4(B1) KF2510-4A_ROT.2
NetDRV_ROT_5: DRV_ROT.5(A1) KF2510-4A_ROT.3
NetDRV_ROT_6: DRV_ROT.6(A2) KF2510-4A_ROT.4
NetDRV_SCISSOR_3: DRV_SCISSOR.3(B2) STEP_SCISSOR.1
NetDRV_SCISSOR_4: DRV_SCISSOR.4(B1) STEP_SCISSOR.2
NetDRV_SCISSOR_5: DRV_SCISSOR.5(A1) STEP_SCISSOR.3
NetDRV_SCISSOR_6: DRV_SCISSOR.6(A2) STEP_SCISSOR.4
NetDRV_SHUTTER_3: DRV_SHUTTER.3(B2) KF4_2_STEP_SHUTTER.1
NetDRV_SHUTTER_4: DRV_SHUTTER.4(B1) KF4_2_STEP_SHUTTER.2
NetDRV_SHUTTER_5: DRV_SHUTTER.5(A1) KF4_2_STEP_SHUTTER.3
NetDRV_SHUTTER_6: DRV_SHUTTER.6(A2) KF4_2_STEP_SHUTTER.4
NetLED2_SCISSOR_1: LED2_SCISSOR.1(A) R4_SCISSOR.2
NetLED3_SHUTTER_1: LED3_SHUTTER.1(A) R5_SHUTTER.2
NetLED_1: LED.1(A) R_ROT1.2
NetLED__MIDDLE_1: LED__MIDDLE.1(A) R3_MIDDLE.2
NetLED__START_1: LED__START.1(A) R1_START.2
NetLED_BOTTOM_1: LED_BOTTOM.1(A) R2_BOTTOM.2
NetLED_PAP1_1: LED_PAP1.1(A) R_PAP1.2
NetLED_PAP2_1: LED_PAP2.1(A) R_PAP2.2
NetLED_PAP3_1: LED_PAP3.1(A) R_PAP3.2
NetLED_PAP4_1: LED_PAP4.1(A) R_PAP4.2
NetLED_ROT2_1: LED_ROT2.1(A) R_ROT2.2
NetLED_UP_1: LED_UP.1(A) R1_UP.2
NetR1_20K_12VBATT_1: R1_20K_12VBATT.1 R2_10K_12VBATT.2 U1-CAMERA.16(A15)
NetR1_STARTBTN_2: R1_STARTBTN.2 TIP120_STARTBTN.1(B)
NetR3_AUX_2: R3_AUX.2 TIP120_AUX.1(B)
NetSW1_2: SW1.2 XT1_POWER_IN.2(12V)
NetTIP120_AUX_2: TIP120_AUX.2(C) XT60_AUX.2

Not connected (* = marked no-connect by the designer): DRV_EXIT 2(FLT)*; DRV_PAPER 2(FLT)*; DRV_ROT 2(FLT)*; DRV_SCISSOR 2(FLT)*; DRV_SHUTTER 2(FLT)*; EXT_DIGITAL_CAMERA 10*; NRF24L01 5*; RTC-DS3231-CONNECTOR 2*; U1-CAMERA 39(VCC)* 40(MISO)* 41(MOSI)* 42(SCK)* 43(GND)* 44(RST)* 75(RX)* 76(TX)* 77(AREF)* 78(RST)* 81(5V)* 82(5V)*; U2-PAPER_PROCESS 16(A15)* 17(D32)* 18(D33)* 19(D34)* 20(D35)* 21(D36)* 22(D37)* 23(D38)* 24(D39)* 25(D40)* 26(D41)* 27(D42)* 33(D48)* 34(D49)* 35(D50)* 36(D51)* 37(D52)* 38(D53)* 39(VCC)* 40(MISO)* 41(MOSI)* 42(SCK)* 43(GND)* 44(RST)* 46(D31)* 75(RX)* 76(TX)* 77(AREF)* 78(RST)* 79(3V3)* 80(3V3)* 81(5V)* 82(5V)*

## Notes on the sheet
- POWER
- //TODO: REGUL ENTREE 12V (alim pc ou batterie)?
- CONNECTORS TO CAMERA
- (near NRF24L01) MODULE_RADIO
- //TODO:CONDO?
- GND
- 6
- TITLE:
- No_Filter_Booth
- Company:
- Flo Gales
- Sheet:
- REV:
- 1.0
- 1/1
- CONNECTORS TO DOOR
- 7
- Date:
- 2020-01-09
- Drawn By:
- 8
- rataflo
- CONNECTORS TO SPIDER
- (in symbol 150ohm) 150R
- (in symbol CAMERA) U1; MEGA2560 PRO-ch340
- (in symbol led) Green
- (in symbol PAPER_PROCESS) U2; MEGA2560 PRO-ch340
- (in symbol ROT2) CONN-TH_3P-P2.00_KF2510_3A
- (in symbol test2) GND

## Library data of the parts
01UF_COIN 01UF_MARQUEE 01UF_MATRIX 01UF_MEGA_PAPER 01UF_RTC 01UF_SEGMENT 100UF_MEGA_CAMERA = 0.1uF: BOM_Manufacturer: ReliaPro; BOM_Manufacturer Part: 0.1uF(104) 100V; Value: 100nF; BOM_Supplier Part: undefined; BOM_Supplier: LCSC; spicePre: C; spiceSymbolName: 0.1uF(104) 100V
100UF_AUX 100UF_PROCESS_LIGHT 100UF_SERVO C1_100UF_PAPER C2_100UF_SHUTTER C3_100UF_SCISSOR C4_100UF_ROT C5_100UF_EXIT = 100uF: description: CAP-08439; Contributor: SparkFun; spicePre: C; spiceSymbolName: 100UF-25V-20%(PTH)
100UF_CEILING 100UF_FLASH 100UF_MARQUEE 100UF_STARTBTN = 100UF: description: CAP-08439; Contributor: SparkFun; spicePre: C; spiceSymbolName: 100UF-25V-20%(PTH)
ALIM_5V = ALIM_5V: Contributor: winter2015; sourceId: YsmgyP7pj; timeStamp: 1455542196; spicePre: U; spiceSymbolName: D24V50F5
BATH_TEMP = TEMP: BOM_Manufacturer: BOOMELE; BOM_Manufacturer Part: kf2510_3A; Package Display: No; spicePre: X; BOM_Supplier: LCSC; image: //image.lceda.cn/szlcsc/C29275.jpg; BOM_Supplier Part: C29275; spiceSymbolName: kf2510_3A
BATT_PROBE = BATT_PROBE: BOM_Manufacturer Part: KF2510-2A; BOM_Manufacturer: BOOMELE; spicePre: X; BOM_Supplier: LCSC; BOM_Supplier Part: C27543; spiceSymbolName: KF2510-2A
BDX53B_FLASH = BDX53B: description: Plastic Medium-Power Complementary Silicon Transistor, 3-Pin TO-220, Tube; spicePre: Q; spiceSymbolName: BDX53B
CEILING = CEILING: BOM_Manufacturer: BOOMELE; BOM_Manufacturer Part: kf2510_3A; spicePre: X; BOM_Supplier: LCSC; image: //image.lceda.cn/szlcsc/C29275.jpg; BOM_Supplier Part: C29275; spiceSymbolName: kf2510_3A
COIN = COIN: BOM_Manufacturer: ReliaPro; BOM_Manufacturer Part: KF2510-4A; spicePre: X; BOM_Supplier Part: C27542; BOM_Supplier: LCSC; image: http://image.lceda.cn/szlcsc/C27542.jpg; spiceSymbolName: KF2510-4A
DC_MOTOR = DC_MOTOR: BOM_Manufacturer Part: KF2510-2A; BOM_Manufacturer: BOOMELE; spicePre: X; BOM_Supplier: LCSC; BOM_Supplier Part: C27543; spiceSymbolName: KF2510-2A
DRV_EXIT = EXIT: BOM_Manufacturer: Pololu; Contributor: KiCAD; license: https://www.gnu.org/licenses/lgpl-2.1.html; spicePre: A; spiceSymbolName: Pololu_Breakout_DRV8825
DRV_PAPER = PAPER: BOM_Manufacturer: Pololu; Contributor: KiCAD; license: https://www.gnu.org/licenses/lgpl-2.1.html; spicePre: A; spiceSymbolName: Pololu_Breakout_DRV8825
DRV_ROT = ROTATION: BOM_Manufacturer: Pololu; Contributor: KiCAD; license: https://www.gnu.org/licenses/lgpl-2.1.html; spicePre: A; spiceSymbolName: Pololu_Breakout_DRV8825
DRV_SCISSOR = SCISSOR: Contributor: KiCAD; license: https://www.gnu.org/licenses/lgpl-2.1.html; spicePre: A; spiceSymbolName: Pololu_Breakout_DRV8825
DRV_SHUTTER = SHUTTER: Contributor: KiCAD; license: https://www.gnu.org/licenses/lgpl-2.1.html; spicePre: A; spiceSymbolName: Pololu_Breakout_DRV8825
EXIT = KF2510-4A: BOM_Manufacturer: ReliaPro; spicePre: X; BOM_Supplier Part: C27542; BOM_Supplier: LCSC; BOM_Manufacturer Part: KF2510-4A; image: http://image.lceda.cn/szlcsc/C27542.jpg; spiceSymbolName: KF2510-4A
EXT_ANALOG_CAMERA = ANALOG_CAMERA: BOM_Manufacturer: ReliaPro; BOM_Manufacturer Part: 1.27mm1*10P Straight Headers  Pins; Contributor: kazanaviciuse; BOM_Supplier Part: C28952; BOM_Supplier: LCSC; image: http://image.lceda.cn/szlcsc/C28952.jpg; spicePre: P; spiceSymbolName: connecteur dupont 15 pins
EXT_ANALOG_PAPER = ANALOG_PAPER: BOM_Manufacturer: ReliaPro; BOM_Manufacturer Part: 1.27mm1*10P Straight Headers  Pins; Contributor: kazanaviciuse; BOM_Supplier Part: C28952; BOM_Supplier: LCSC; image: http://image.lceda.cn/szlcsc/C28952.jpg; spicePre: P; spiceSymbolName: connecteur dupont 15 pins
EXT_DIGITAL_CAMERA = EXT_DIGITAL_CAMERA: Contributor: 12_subhu; spicePre: C; spiceSymbolName: Header 10X1_Female
EXT_DIGITAL_PAPER = DIGITAL_PAPER: BOM_Manufacturer: ReliaPro; BOM_Manufacturer Part: 1.27mm1*10P Straight Headers  Pins; Contributor: kazanaviciuse; BOM_Supplier Part: C28952; BOM_Supplier: LCSC; image: http://image.lceda.cn/szlcsc/C28952.jpg; spicePre: P; spiceSymbolName: connecteur dupont 15 pins
KF2_ENDSTOP_DOWN = BOTTOM: BOM_Manufacturer Part: KF2510-2A; BOM_Manufacturer: BOOMELE; spicePre: X; BOM_Supplier: LCSC; BOM_Supplier Part: C27543; spiceSymbolName: KF2510-2A
KF2_ENDSTOP_MIDDLE = MIDDLE: BOM_Manufacturer Part: KF2510-2A; BOM_Manufacturer: BOOMELE; spicePre: X; BOM_Supplier: LCSC; BOM_Supplier Part: C27543; spiceSymbolName: KF2510-2A
KF2_ENDSTOP_UP = UP: BOM_Manufacturer Part: KF2510-2A; BOM_Manufacturer: BOOMELE; spicePre: X; BOM_Supplier: LCSC; BOM_Supplier Part: C27543; spiceSymbolName: KF2510-2A
KF4_2_STEP_SHUTTER = SHUTTER: BOM_Manufacturer: ReliaPro; BOM_Manufacturer Part: KF2510-4A; spicePre: X; BOM_Supplier Part: C27542; BOM_Supplier: LCSC; image: http://image.lceda.cn/szlcsc/C27542.jpg; spiceSymbolName: KF2510-4A
KF4_3_STEP_PAPER = PAPER: BOM_Manufacturer: ReliaPro; BOM_Manufacturer Part: KF2510-4A; spicePre: X; BOM_Supplier Part: C27542; BOM_Supplier: LCSC; image: http://image.lceda.cn/szlcsc/C27542.jpg; spiceSymbolName: KF2510-4A
KF2510-4A-START_BTN = START: BOM_Manufacturer: ReliaPro; BOM_Manufacturer Part: KF2510-4A; spicePre: X; BOM_Supplier Part: C27542; BOM_Supplier: LCSC; image: http://image.lceda.cn/szlcsc/C27542.jpg; spiceSymbolName: KF2510-4A
KF2510-4A_ROT = ROTATION: BOM_Manufacturer: ReliaPro; BOM_Manufacturer Part: KF2510-4A; spicePre: X; BOM_Supplier Part: C27542; BOM_Supplier: LCSC; image: http://image.lceda.cn/szlcsc/C27542.jpg; spiceSymbolName: KF2510-4A
LED LED2_SCISSOR LED3_SHUTTER LED__MIDDLE LED__START LED_BOTTOM LED_PAP1-LED_PAP4 LED_ROT2 LED_UP = led: BOM_Manufacturer Part: 5MMGREENLED; BOM_Price (USD): 0.01; Contributor: damanbaral; BOM_Supplier: AliExpress; BOM_Link: https://www.aliexpress.com/item/100Pcs-LED-5MM-RED-COLOR-RED-LIGHT-Super-Bright-Bulb-Lamp/32224565677.html?spm=2114.search0104.3.83.34af337eTmEG90&ws_ab_test=searchweb0_0,searchweb201602_1_10152_10151; spicePre: L; spiceSymbolName: 5mm Green LED
LEDMATRIX = MATRIX: BOM_Manufacturer: ReliaPro; spicePre: X; BOM_Supplier Part: C27544; BOM_Supplier: LCSC; BOM_Manufacturer Part: KF2510-5A; spiceSymbolName: KF2510-5A
LUX_SENSOR = LUX_SENSOR: BOM_Manufacturer: ReliaPro; BOM_Manufacturer Part: KF2510-4A; spicePre: X; BOM_Supplier Part: C27542; BOM_Supplier: LCSC; image: http://image.lceda.cn/szlcsc/C27542.jpg; spiceSymbolName: KF2510-4A
MARQUEE = MARQUEE: BOM_Manufacturer: BOOMELE; BOM_Manufacturer Part: kf2510_3A; spicePre: X; BOM_Supplier: LCSC; image: //image.lceda.cn/szlcsc/C29275.jpg; BOM_Supplier Part: C29275; spiceSymbolName: kf2510_3A
NRF24L01 = NRF24: BOM_Manufacturer Part: Custom; Contributor: Niels Overwijn; spicePre: H; spiceSymbolName: Dupont_2x4
PROCESS_LIGHT = LIGHT: BOM_Manufacturer: BOOMELE; BOM_Manufacturer Part: kf2510_3A; spicePre: X; BOM_Supplier: LCSC; image: //image.lceda.cn/szlcsc/C29275.jpg; BOM_Supplier Part: C29275; spiceSymbolName: kf2510_3A
R1_20K_12VBATT = 20k: BOM_Manufacturer: MULTICOMP; BOM_Manufacturer Part: CFR16J15K; Power: 1/4W; Tolerance: ±5%; Contributor: Prof. Ing. F. Scordino; Value: 20k; BOM_Supplier Part: 2329483; BOM_Supplier: Element14; Link: http://www.farnell.com/datasheets/1716726.pdf?_ga=2.264431951.1329011990.1547499138-1507623165.1547499138; spicePre: R; spiceSymbolName: 20k
R1_START R1_UP R2_BOTTOM R3_MIDDLE R4_SCISSOR R5_SHUTTER R_PAP1-R_PAP4 R_ROT1 R_ROT2 = 150ohm: Contributor: elpeewee; BOM_Supplier Part: undefined; spicePre: R; spiceSymbolName: Resistor_150R/0.6W
R1_STARTBTN R2_FLASH R3_AUX = 2.2K: BOM_Manufacturer Part: FHCFR-1/4W-222J; description: DIP RES 2.2K-5%-1/4W;; BOM_Supplier Part: 301020010; BOM_Supplier: SeeedStudio; spicePre: R; spiceSymbolName: 2.2K
R2_10K_12VBATT = 10k: BOM_Manufacturer: MULTICOMP; BOM_Manufacturer Part: CFR16J15K; Power: 1/4W; Value: 20k; Tolerance: ±5%; Contributor: Prof. Ing. F. Scordino; BOM_Supplier Part: 2329483; BOM_Supplier: Element14; Link: http://www.farnell.com/datasheets/1716726.pdf?_ga=2.264431951.1329011990.1547499138-1507623165.1547499138; spicePre: R; spiceSymbolName: 20k
RTC-DS3231-CONNECTOR = RTC: Contributor: joeduderey; Package Display: No; spicePre: U; spiceSymbolName: 5Pin Dupont
SEGMENT = SEGMENT: BOM_Manufacturer: ReliaPro; BOM_Manufacturer Part: KF2510-4A; spicePre: X; BOM_Supplier Part: C27542; BOM_Supplier: LCSC; image: http://image.lceda.cn/szlcsc/C27542.jpg; spiceSymbolName: KF2510-4A
SERVO = SERVO: BOM_Manufacturer: BOOMELE; BOM_Manufacturer Part: kf2510_3A; spicePre: X; BOM_Supplier: LCSC; image: //image.lceda.cn/szlcsc/C29275.jpg; BOM_Supplier Part: C29275; spiceSymbolName: kf2510_3A
STEP_SCISSOR = SCISSOR: BOM_Manufacturer: ReliaPro; BOM_Manufacturer Part: KF2510-4A; spicePre: X; BOM_Supplier Part: C27542; BOM_Supplier: LCSC; image: http://image.lceda.cn/szlcsc/C27542.jpg; spiceSymbolName: KF2510-4A
SW1 = RT-S01-145-L1NB1B: BOM_Manufacturer: ROCKTEK; Contributor: LCSC; BOM_Supplier: LCSC; BOM_Supplier Part: C312627; BOM_Manufacturer Part: RT-S01-145-L1NB1B; spicePre: S; spiceSymbolName: RT-S01-145-L1NB1B
SW_PAP1 = PAPER1: BOM_Manufacturer: BOOMELE; BOM_Manufacturer Part: kf2510_3A; spicePre: X; BOM_Supplier: LCSC; image: //image.lceda.cn/szlcsc/C29275.jpg; BOM_Supplier Part: C29275; spiceSymbolName: kf2510_3A
SW_PAP2 = PAPER2: BOM_Manufacturer: BOOMELE; BOM_Manufacturer Part: kf2510_3A; spicePre: X; BOM_Supplier: LCSC; image: //image.lceda.cn/szlcsc/C29275.jpg; BOM_Supplier Part: C29275; spiceSymbolName: kf2510_3A
SW_PAP3 = PAPER3: BOM_Manufacturer: BOOMELE; BOM_Manufacturer Part: kf2510_3A; spicePre: X; BOM_Supplier: LCSC; image: //image.lceda.cn/szlcsc/C29275.jpg; BOM_Supplier Part: C29275; spiceSymbolName: kf2510_3A
SW_PAP4 = PAPER4: BOM_Manufacturer: BOOMELE; BOM_Manufacturer Part: kf2510_3A; spicePre: X; BOM_Supplier: LCSC; image: //image.lceda.cn/szlcsc/C29275.jpg; BOM_Supplier Part: C29275; spiceSymbolName: kf2510_3A
SW_ROT1 = ROT1: BOM_Manufacturer: BOOMELE; BOM_Manufacturer Part: kf2510_3A; spicePre: X; BOM_Supplier: LCSC; image: //image.lceda.cn/szlcsc/C29275.jpg; BOM_Supplier Part: C29275; spiceSymbolName: kf2510_3A
SW_ROT2 = ROT2: BOM_Manufacturer: BOOMELE; BOM_Manufacturer Part: kf2510_3A; Package Display: Yes; spicePre: X; BOM_Supplier: LCSC; image: //image.lceda.cn/szlcsc/C29275.jpg; BOM_Supplier Part: C29275; spiceSymbolName: kf2510_3A
SW_SCISSOR = SCISSOR: BOM_Manufacturer Part: KF2510-2A; BOM_Manufacturer: BOOMELE; spicePre: X; BOM_Supplier: LCSC; BOM_Supplier Part: C27543; spiceSymbolName: KF2510-2A
SW_SHUTTER = SHUTTER: BOM_Manufacturer Part: KF2510-2A; BOM_Manufacturer: BOOMELE; spicePre: X; BOM_Supplier: LCSC; BOM_Supplier Part: C27543; spiceSymbolName: KF2510-2A
TIP120_AUX TIP120_STARTBTN = TIP120: BOM_Manufacturer: STMicroelectronics; Contributor: LCSC; BOM_Supplier: LCSC; BOM_Supplier Part: C262990; BOM_Manufacturer Part: TIP120; spicePre: Q; spiceSymbolName: TIP120
U1-CAMERA = CAMERA: BOM_Manufacturer: RobotDyn; Contributor: brandstetter.sys; BOM_Manufacturer Part: MEGA2560 PRO-ch340G; BOM_Supplier: RobotDyn; BOM_Supplier Part: MEGA2560 PRO-ch340G; link: https://robotdyn.com/mega-2560-pro-embed-ch340g-atmega2560-16au.html; spicePre: U; spiceSymbolName: MEGA2560 PRO-ch340G
U2-PAPER_PROCESS = PAPER_PROCESS: BOM_Manufacturer: RobotDyn; Contributor: brandstetter.sys; BOM_Manufacturer Part: MEGA2560 PRO-ch340G; BOM_Supplier: RobotDyn; BOM_Supplier Part: MEGA2560 PRO-ch340G; link: https://robotdyn.com/mega-2560-pro-embed-ch340g-atmega2560-16au.html; spicePre: U; spiceSymbolName: MEGA2560 PRO-ch340G
U-DRIVER_DC_ROTATION = CYTRON MD10C: BOM_Manufacturer Part: Cytron 13A, 5-30V Single DC Motor Controller; Contributor: Clemence; Package Display: No; BOM_Supplier Part: undefined; link: https://www.robotshop.com/eu/fr/controleur-un-moteur-13a-5-a-30v-cytron.html?gclid=CjwKCAjwx_boBRA9EiwA4kIELt4WXOb_eNtyrzZ7S0Ph3qvcU_ZLf4o937LRN9Sbs-uF-rttO4zhyBoCeLIQAvD_BwE; spicePre: U; spiceSymbolName: CYTRON 13A - MD10C R3
XT1_POWER_IN = POWER_IN_12V: Contributor: Drone_H2EA; spicePre: U; spiceSymbolName: XT60
XT60-FLASH = FLASH: Contributor: Drone_H2EA; spicePre: U; spiceSymbolName: XT60
XT60_AUX = AUX: Contributor: Drone_H2EA; spicePre: U; spiceSymbolName: XT60